# EAGLE design canAIReSensor (EAGLE 6.4)
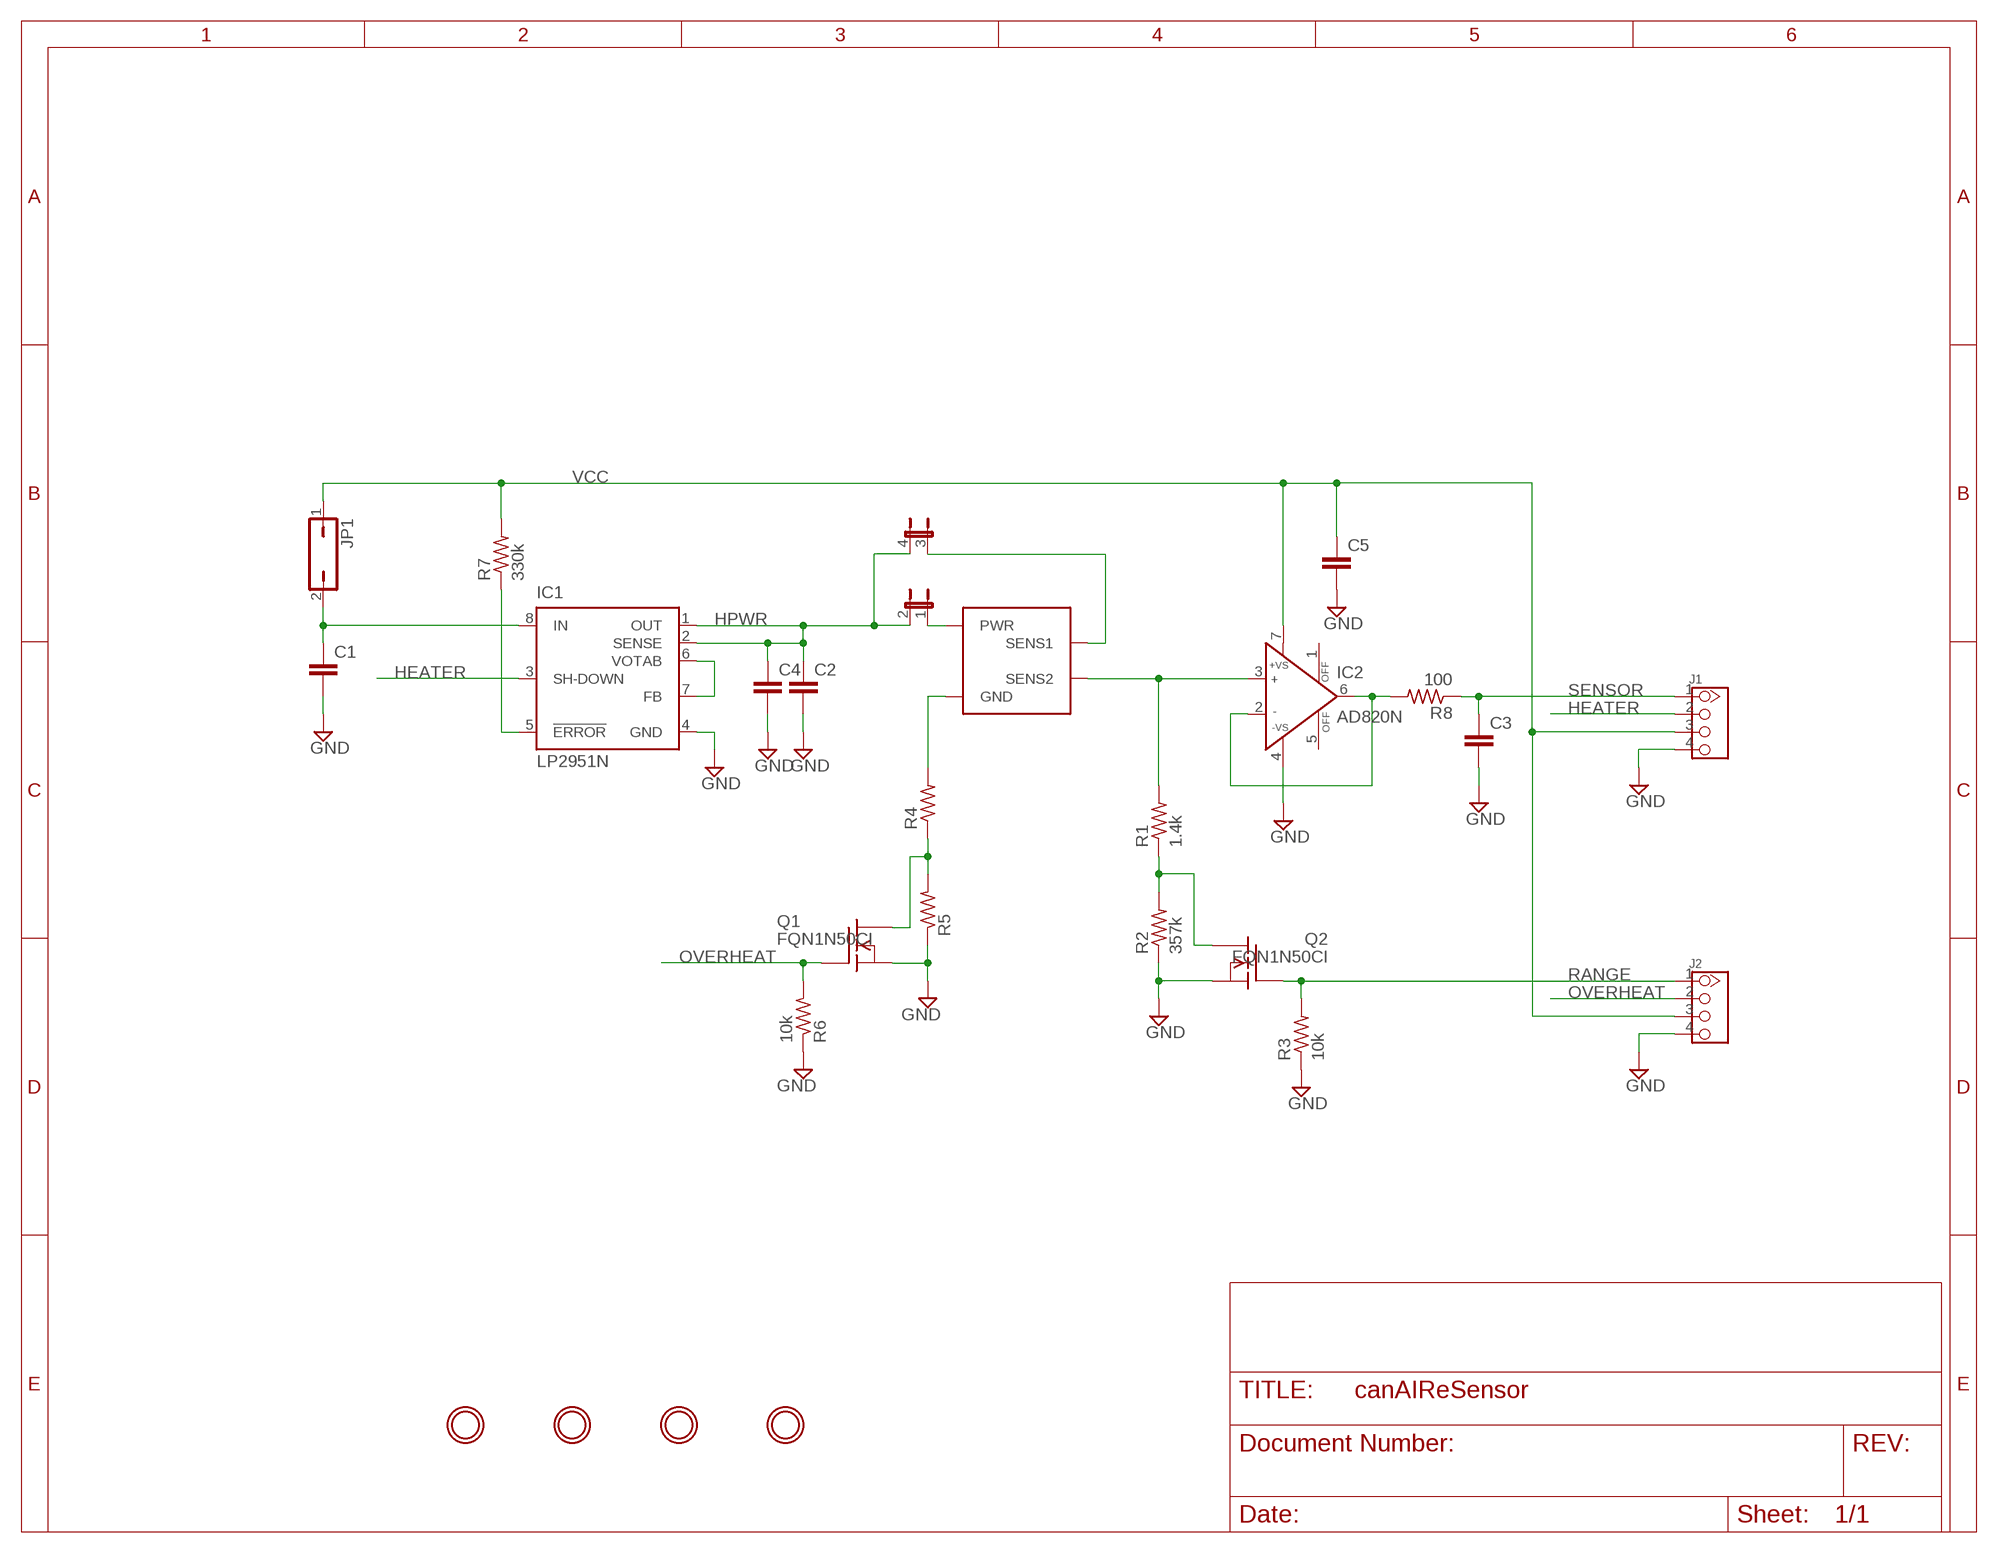
[diagram p0: schematic, sheet 1]

## Parts
C1  C-EU050-024X044  [C050-024X044]
C2  C-EU050-024X044  [C050-024X044]
C3  C-EU050-024X044  [C050-024X044]
C4  C-EU050-024X044  [C050-024X044]
C5  C-EU050-024X044  [C050-024X044]
IC1  LP2951N  [DIL08]
IC2  AD820N  [DIL08]
J1  TWIG-4P-2.0'90D'  [4P-2.0-90D]
J2  TWIG-4P-2.0'90D'  [4P-2.0-90D]
JP1  JP1Q  [JP1]
JP4  JP2QE  [JP2Q]
Q1  FQN1N50CI  [TO92-INLINE]
Q2  FQN1N50CI  [TO92-INLINE]
R1  1.4k  R-US_0204/7  [0204/7]
R2  357k  R-US_0204/7  [0204/7]
R3  10k  R-US_0204/7  [0204/7]
R4  R-US_0204/7  [0204/7]
R5  R-US_0204/7  [0204/7]
R6  10k  R-US_0204/7  [0204/7]
R7  330k  R-US_0204/7  [0204/7]
R8  100  R-US_0204/7  [0204/7]
U$1  E2V_MICS  [E2V_MICS]
U$2  MOUNTINGHOLE2.5  [MOUNTINGHOLE_2.5_PLATED]
U$3  MOUNTINGHOLE2.5  [MOUNTINGHOLE_2.5_PLATED]
U$4  MOUNTINGHOLE2.5  [MOUNTINGHOLE_2.5_PLATED]
U$5  MOUNTINGHOLE2.5  [MOUNTINGHOLE_2.5_PLATED]

## Nets
GND: C1.2 C2.2 C3.2 C4.2 C5.2 IC1.4(GND) IC2.4(-VS) J1.4 J2.4 Q1.3(S) Q2.3(S) R2.1 R3.1 R5.1 R6.1
HEATER: IC1.3(SH-DOWN) J1.2
HPWR: C2.1 C4.1 IC1.1(OUT) IC1.2(SENSE) JP4.2 JP4.4
N$1: Q2.1(D) R1.1 R2.2
N$2: R4.2 U$1.1(GND)
N$3: JP4.1 U$1.3(PWR)
N$4: IC1.6(VOTAB) IC1.7(FB)
N$5: C1.1 IC1.8(IN) JP1.2
N$6: Q1.1(D) R4.1 R5.2
N$7: IC1.5(!ERROR) R7.1
N$9: IC2.2(IN-) IC2.6(OUT) R8.2
OVERHEAT: J2.2 Q1.2(G) R6.2
RANGE: J2.1 Q2.2(G) R3.2
S1: JP4.3 U$1.4(SENS1)
S2: IC2.3(IN+) R1.2 U$1.2(SENS2)
SENSOR: C3.1 J1.1 R8.1
VCC: C5.1 IC2.7(+VS) J1.3 J2.3 JP1.1 R7.2
Unconnected: IC2.1(OFF) IC2.5(OFF)

## Library data of the parts
C1-C5 = rcl:C-EU: CAPACITOR, European symbol
IC1 = linear:LP2951: 100 mA, Low Power Low Dropout Voltage Regulator Source: http://www.onsemi.com/pub/Collateral/LP2950-D.PDF
IC2 = analog-devices:AD820N: Single-Supply, Rail-to-Rail, Low Power, FET Input Op Amp Source: http://www.analog.com/static/imported-files/data_sheets/AD820.pdf; OC_FARNELL: 1438579; OC_NEWARK: unknown
J1 J2 = Connector:TWIG-4P-2.0
JP1 = jumper:JP1Q: JUMPER
JP4 = jumper:JP2QE: JUMPER
Q1 Q2 = adafruit:FQN1N50C: N-Channel Enhancement MOSFET 500V, 0.4A, 6.0 Ohm
R1-R8 = rcl:R-US_: RESISTOR, American symbol
U$1 = open_hw_sockets:E2V_MICS
U$2-U$5 = microbuilder:MOUNTINGHOLE: Mounting Hole For #2 screws (0.086"/2.18mm width, 0.094"/2.4mm hole) use 2.5mm

## Board
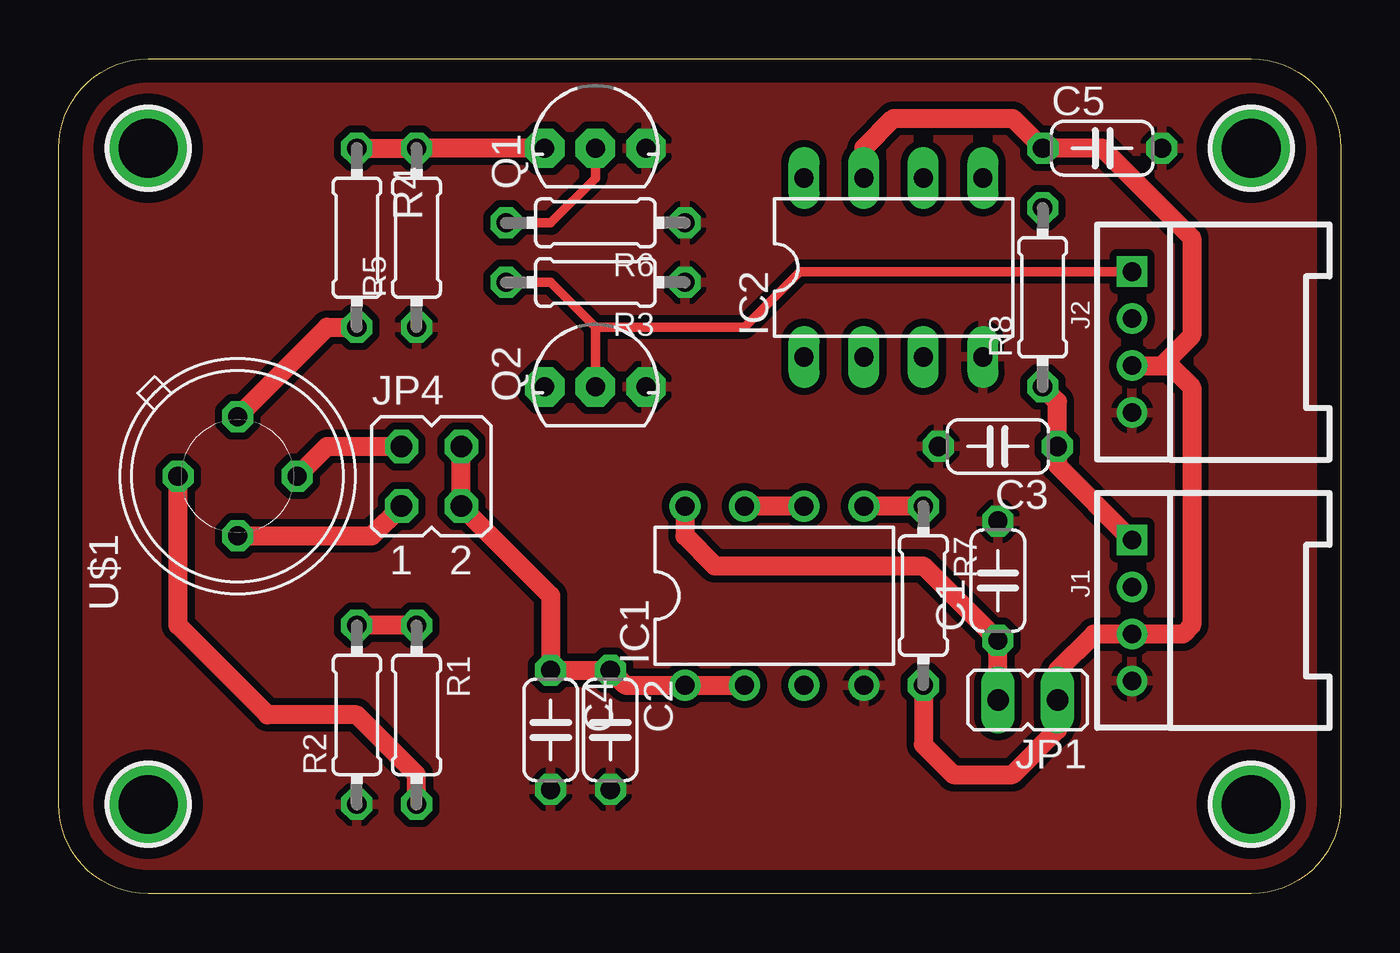
[diagram p1: board, top side]
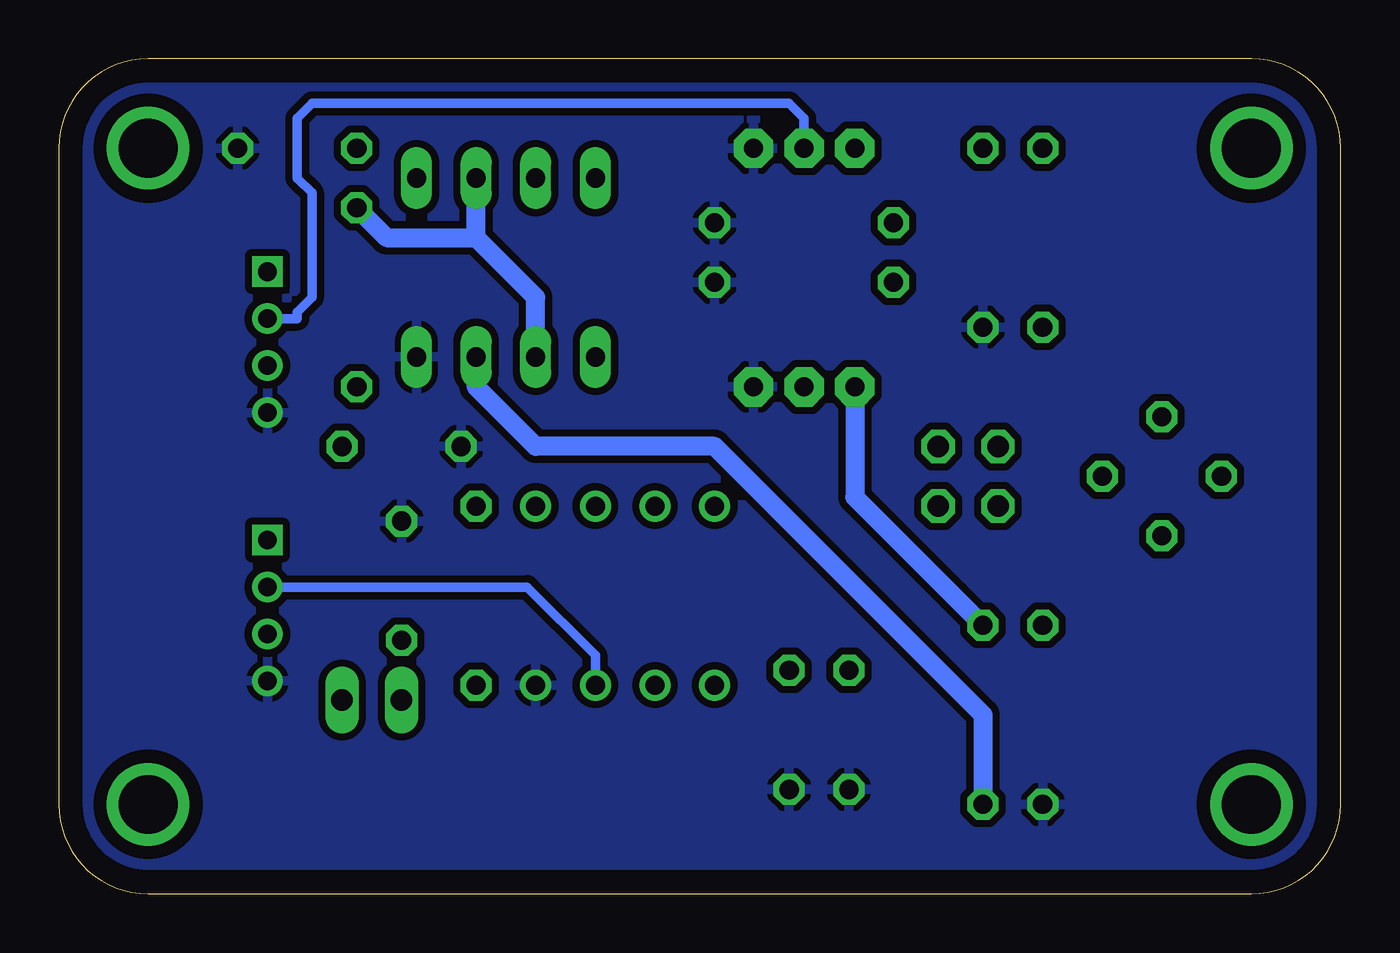
[diagram p2: board, bottom side, seen from below]

Size 54.61 x 35.56 mm. Coordinates in mm from the lower left corner, seen from the top.
Outline: 0,31.75 arc-90 3.81,35.56 50.8,35.56 arc-90 54.61,31.75 54.61,3.81 arc-90 50.8,0 3.81,0 arc-90 0,3.81 0,31.75
Copper layers (1*16): Top 0.035mm / dielectric 1.5mm / Bottom 0.035mm
Design rules "default": minimum track width 10mil, minimum drill 24mil, track to track 8mil, track to pad 8mil, pad to pad 8mil, via to via 8mil, smd to smd 8mil, copper to edge 40mil, drill to drill 8mil, minimum pad ring 10mil, minimum via ring 8mil, stop-mask expansion 4mil, vias tented up to drill 0mil, thermal gap 10mil

### Footprints (pad centres in the part's own frame; a part is rotated, then mirrored left to right if it is on the bottom)
C050-024X044 = drill 0.813 octagon: 1 -2.54,0; 2 2.54,0
DIL08 = drill 0.813 pad 1.27: 1 -3.81,-3.81; 2 -1.27,-3.81; 3 1.27,-3.81; 4 3.81,-3.81; 5 3.81,3.81; 6 1.27,3.81; 7 -1.27,3.81; 8 -3.81,3.81
DIL08' = drill 0.813 long: 1 -3.81,-3.81; 2 -1.27,-3.81; 3 1.27,-3.81; 4 3.81,-3.81; 5 3.81,3.81; 6 1.27,3.81; 7 -1.27,3.81; 8 -3.81,3.81
4P-2.0-90D = drill 0.8 pad 1.27 square: 1 -3,0 | drill 0.8 pad 1.27: 2 -1,0; 3 1,0; 4 3,0
JP1 = drill 0.914 long: 1 0,-1.27; 2 0,1.27
JP2Q = drill 0.914 octagon: 1 -1.27,-1.27; 2 1.27,-1.27; 3 -1.27,1.27; 4 1.27,1.27
TO92-INLINE = drill 0.813 pad 1.676 octagon: 1 -2.159,0; 2 0,0; 3 2.159,0
0204/7 = drill 0.813 octagon: 1 -3.81,0; 2 3.81,0
E2V_MICS = drill 0.813 octagon: 1 0,-2.54; 2 2.54,0; 3 0,2.54; 4 -2.54,0
MOUNTINGHOLE_2.5_PLATED = drill 2.5 pad 3.2: P$1 0,0

### Placement (x,y rotation side)
C1  40.01,13.34 90 top
C2  23.5,6.99 270 top
C3  40.01,19.05 180 top
C4  20.95,6.99 270 top
C5  44.45,31.75 0 top
IC1  30.48,12.7 0 top
IC2  AD820N  [DIL08']  35.56,26.67 0 top
J1  45.72,12.06 270 top
J2  45.72,23.5 270 top
JP1  41.27,8.26 90 top
JP4  15.88,17.78 0 top
Q1  22.86,31.75 0 top
Q2  22.86,21.59 0 top
R1  15.24,7.62 270 top
R2  12.7,7.62 90 top
R3  22.86,26.04 180 top
R4  12.7,27.94 270 top
R5  15.24,27.94 90 top
R6  22.86,28.57 180 top
R7  36.83,12.7 270 top
R8  41.91,25.4 90 top
U$1  7.62,17.78 180 top
U$2  3.81,3.81 0 top
U$3  3.81,31.75 0 top
U$4  50.8,31.75 0 top
U$5  50.8,3.81 0 top

### Tracks (layer width: path | path; a pad name or v marks a point on that pad's centre or on a via)
GND
  pour Bottom (isolate 0.305): 0,0 54.61,0 54.61,35.56 0,35.56
  pour Top (isolate 0.305): 0,35.56 54.61,35.56 54.61,0 0,0
HEATER
  Bottom 0.406: J1.2 34.66,13.06 31.75,10.16 IC1.3
HPWR
  Top 0.813: IC1.2 IC1.1 24.13,8.89 C2.1 C4.1 20.95,12.7 JP4.2 JP4.4
N$1
  Top 0.813: R1.1 R2.2
  Bottom 0.813: Q2.1 20.7,16.89 16.51,12.7 R1.1
N$2
  Top 0.813: U$1.1 11.43,24.13 R4.2
N$3
  Top 0.813: U$1.3 13.34,15.24 JP4.1
N$4
  Top 0.813: IC1.6 IC1.7
N$5
  Top 0.813: IC1.8 26.67,15.24 27.94,13.97 36.83,13.97 C1.1 JP1.2
N$6
  Top 0.813: R4.1 R5.2 16.51,31.75 Q1.1
N$7
  Top 0.813: R7.1 IC1.5
N$9
  Bottom 0.813: IC2.2 34.29,25.4 36.83,27.94 | 36.83,27.94 IC2.6 | R8.2 40.64,27.94 36.83,27.94
OVERHEAT
  Top 0.406: Q1.2 22.86,30.48 20.95,28.57 R6.2
  Bottom 0.406: Q1.2 22.86,33.02 23.5,33.66 43.81,33.66 44.45,33.02 44.45,30.48 43.81,29.84 43.81,25.4 44.45,24.77 44.45,24.5 J2.2
RANGE
  Top 0.406: R3.2 20.95,26.04 22.86,24.13 | 22.86,24.13 Q2.2 | J2.1 31.57,26.5 29.21,24.13 22.86,24.13
S1
  Top 0.813: U$1.4 11.43,19.05 JP4.3
S2
  Top 0.813: R1.2 15.24,5.08 12.7,7.62 8.89,7.62 5.08,11.43 U$1.2
  Bottom 0.813: IC2.3 36.83,21.59 34.29,19.05 26.67,19.05 15.24,7.62 R1.2
SENSOR
  Top 0.813: J1.1 42.55,18.24 C3.1 42.55,20.95 R8.1
VCC
  Top 0.813: J2.3 46.99,22.5 | 46.99,22.5 47.35,22.5 48.26,21.59 48.26,11.43 47.9,11.06 J1.3 44.09,11.06 42.55,9.53 JP1.1 42.55,6.99 40.64,5.08 38.1,5.08 36.83,6.35 R7.2 | 46.99,22.5 48.26,23.77 48.26,27.94 44.45,31.75 C5.1 40.64,33.02 35.56,33.02 34.29,31.75 IC2.7